# EAGLE design controller (EAGLE 7.3.0)
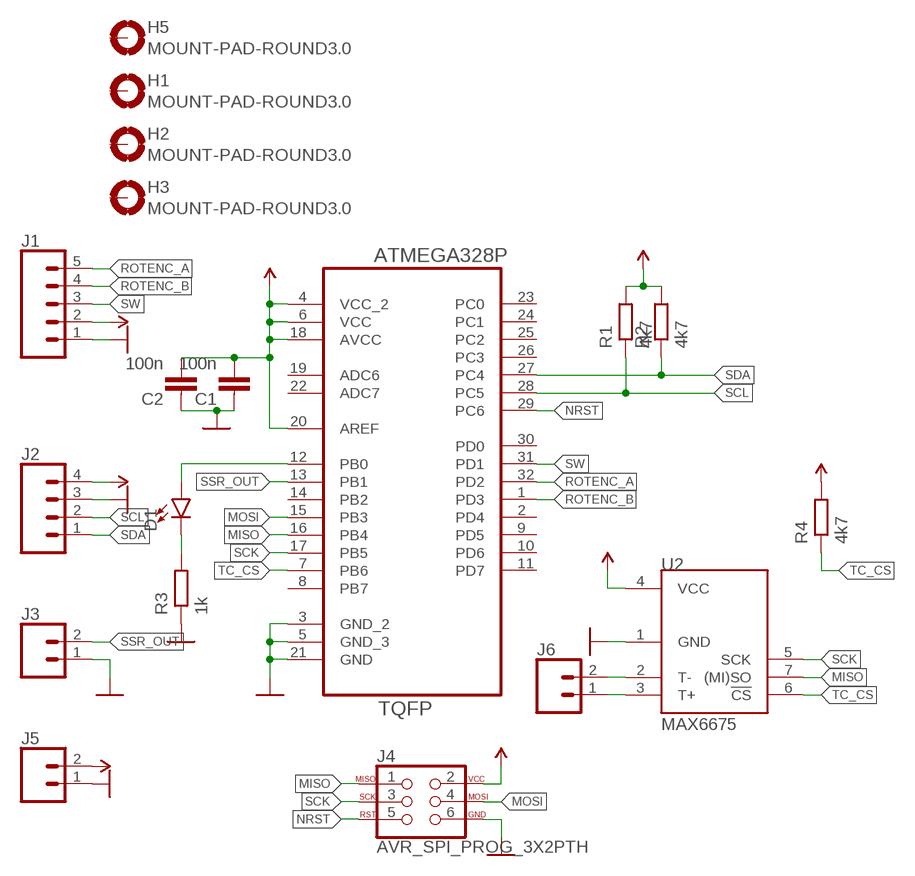
[diagram p0: schematic, sheet 1]

## Parts
C1  100n  CAPACITOR0603-N  [C0603-N]
C2  100n  CAPACITOR0603-N  [C0603-N]
D1  LED0603  [LED-0603]
H1  MOUNT-PAD-ROUND3.0  [3,0-PAD]
H2  MOUNT-PAD-ROUND3.0  [3,0-PAD]
H3  MOUNT-PAD-ROUND3.0  [3,0-PAD]
H5  MOUNT-PAD-ROUND3.0  [3,0-PAD]
J1  CONN_05PTH_LONGPADS  [1X05_LONGPADS]
J2  CONN_04LONGPADS  [1X04_LONGPADS]
J3  CONN_02PTH3  [1X02_LONGPADS]
J4  AVR_SPI_PROG_3X2PTH  [2X3]
J5  CONN_02PTH3  [1X02_LONGPADS]
J6  CONN_02PTH3  [1X02_LONGPADS]
R1  4k7  RESISTOR0603-N  [R0603-N]
R2  4k7  RESISTOR0603-N  [R0603-N]
R3  1k  RESISTOR0603-N  [R0603-N]
R4  4k7  RESISTOR0603-N  [R0603-N]
U1  ATMEGA328P-AU  [QFP80P900X900X120-32N]
U2  MAX6675  [SOIC8]

## Nets
GND: C1.1 C2.1 J1.1 J2.3 J3.1 J4.6 J5.1 R3.1 U1.3(GND_2) U1.5(GND_3) U1.21(GND) U2.1(GND)
MISO: J4.1 U1.16(PB4) U2.7((MI)SO)
MOSI: J4.4 U1.15(PB3)
N$1: D1.A U1.12(PB0)
N$2: D1.C R3.2
N$3: J6.2 U2.2(T-)
N$4: J6.1 U2.3(T+)
NRST: J4.5 U1.29(PC6)
ROTENC_A: J1.5 U1.32(PD2)
ROTENC_B: J1.4 U1.1(PD3)
SCK: J4.3 U1.17(PB5) U2.5(SCK)
SCL: J2.2 R1.1 U1.28(PC5)
SDA: J2.1 R2.1 U1.27(PC4)
SSR_OUT: J3.2 U1.13(PB1)
SW: J1.3 U1.31(PD1)
TC_CS: R4.1 U1.7(PB6) U2.6(!CS)
VCC: C1.2 C2.2 J1.2 J2.4 J4.2 J5.2 R1.2 R2.2 R4.2 U1.4(VCC_2) U1.6(VCC) U1.18(AVCC) U1.20(AREF) U2.4(VCC)
Unconnected: H1.B3,0(MOUNT) H2.B3,0(MOUNT) H3.B3,0(MOUNT) H5.B3,0(MOUNT) U1.2(PD4) U1.8(PB7) U1.9(PD5) U1.10(PD6) U1.11(PD7) U1.14(PB2) U1.19(ADC6) U1.22(ADC7) U1.23(PC0) U1.24(PC1) U1.25(PC2) U1.26(PC3) U1.30(PD0)

## Library data of the parts
C1 C2 = passives-7351:CAPACITOR
D1 = SparkFun-LED:LED: LED (Generic) Standard schematic elements and footprints for 5mm, 3mm, 1206, and 0603 sized LEDs. Generic LEDs with no color specified.
H1-H3 H5 = holes:MOUNT-PAD-ROUND: MOUNTING PAD, round
J1 = SparkFun-Connectors:CONN_05: Multi connection point. Often used as Generic Header-pin footprint for 0.1 inch spaced/style header connections On any of the 0.1 inch spaced packages, you can populate with these: Break Away Headers - Straight <https://www.sparkfun.com/products/116> (PRT-00116) Break Away Male Headers - Right Angle <https://www.sparkfun.com/products/553> (PRT-00553) Female Headers <https://www.sparkfun.com/products/115> (PRT-00115) Break Away Headers - Machine Pin <https://www.sparkfun.com/products/117> (PRT-00117) Break Away Female Headers - Swiss Machine Pin <https://www.sparkfun.com/products/743> (PRT-00743) For SCREWTERMINALS and SPRING TERMINALS visit here: Screw Terimnals on SparkFun.com <https://www.sparkfun.com/search/results?term=Screw+Terminals> (5mm/3.5mm/2.54mm spacing) This device is also useful as a general connection point to wire up your design to another part of your project. Our various solder wires solder well into these plated through hole pads. Hook-Up Wire - Assortment (Stranded, 22 AWG) <https://www.sparkfun.com/products/11375> (PRT-11375) Hook-Up Wire - Assortment (Solid Core, 22 AWG) <https://www.sparkfun.com/products/11367> (PRT-11367) View the entire wire category on our website here <https://www.sparkfun.com/categories/141> Special notes: Molex polarized connector foot print use with SKU : PRT-08231 with associated crimp pins and housings. 1MM SMD Version SKU: PRT-10208
J2 = SparkFun-Connectors:CONN_04: Multi connection point. Often used as Generic Header-pin footprint for 0.1 inch spaced/style header connections On any of the 0.1 inch spaced packages, you can populate with these: Break Away Headers - Straight <https://www.sparkfun.com/products/116> (PRT-00116) Break Away Male Headers - Right Angle <https://www.sparkfun.com/products/553> (PRT-00553) Female Headers <https://www.sparkfun.com/products/115> (PRT-00115) Break Away Headers - Machine Pin <https://www.sparkfun.com/products/117> (PRT-00117) Break Away Female Headers - Swiss Machine Pin <https://www.sparkfun.com/products/743> (PRT-00743) For SCREWTERMINALS and SPRING TERMINALS visit here: Screw Terimnals on SparkFun.com <https://www.sparkfun.com/search/results?term=Screw+Terminals> (5mm/3.5mm/2.54mm spacing) This device is also useful as a general connection point to wire up your design to another part of your project. Our various solder wires solder well into these plated through hole pads. Hook-Up Wire - Assortment (Stranded, 22 AWG) <https://www.sparkfun.com/products/11375> (PRT-11375) Hook-Up Wire - Assortment (Solid Core, 22 AWG) <https://www.sparkfun.com/products/11367> (PRT-11367) View the entire wire category on our website here <https://www.sparkfun.com/categories/141> Special notes: Molex polarized connector foot print use with SKU : PRT-08231 with associated crimp pins and housings. 1MM SMD Version SKU: PRT-10208; PROD_ID: CONN-09696
J3 J5 J6 = SparkFun-Connectors:CONN_02: Multi connection point. Often used as Generic Header-pin footprint for 0.1 inch spaced/style header connections On any of the 0.1 inch spaced packages, you can populate with these: Break Away Headers - Straight <https://www.sparkfun.com/products/116> (PRT-00116) Break Away Male Headers - Right Angle <https://www.sparkfun.com/products/553> (PRT-00553) Female Headers <https://www.sparkfun.com/products/115> (PRT-00115) Break Away Headers - Machine Pin <https://www.sparkfun.com/products/117> (PRT-00117) Break Away Female Headers - Swiss Machine Pin <https://www.sparkfun.com/products/743> (PRT-00743) For SCREWTERMINALS and SPRING TERMINALS visit here: Screw Terimnals on SparkFun.com <https://www.sparkfun.com/search/results?term=Screw+Terminals> (5mm/3.5mm/2.54mm spacing) This device is also useful as a general connection point to wire up your design to another part of your project. Our various solder wires solder well into these plated through hole pads. Hook-Up Wire - Assortment (Stranded, 22 AWG) <https://www.sparkfun.com/products/11375> (PRT-11375) Hook-Up Wire - Assortment (Solid Core, 22 AWG) <https://www.sparkfun.com/products/11367> (PRT-11367) View the entire wire category on our website here <https://www.sparkfun.com/categories/141> Special notes: Molex polarized connector foot print use with: PRT-08233 with associated crimp pins and housings. 2.54_SCREWTERM for use with PRT-10571. 3.5mm Screw Terminal footprints for PRT-08084 5mm Screw Terminal footprints for use with PRT-08432
J4 = SparkFun-Connectors:AVR_SPI_PROG_3X2: AVR ISP 6 Pin This is the reduced ISP connector for AVR programming. Common on Arduino. This footprint will take up less PCB space and can be used with a 10-pin to 6-pin adapter such as SKU: BOB-08508 **Special note about "TEST_POINT" package. The stop mask is on the top side, so if you want your programming test points to be on the bottom of your board, make sure to place this package on the bottom side of the board. This also ensure that the orientation to program from the bottom side will be correct. SparkFun Products: SparkFun ISP Pogo Adapter <https://www.sparkfun.com/products/11591> - NS Tiny AVR Programmer <https://www.sparkfun.com/products/11801> -PTH
R1-R4 = passives-7351:RESISTOR
U1 = Ava:ATMEGA328P-AU; DESCRIPTION: 8-bit Microcontroller with In-System Programmable Flash; MPN: ATMEGA328P-AU; OC_FARNELL: 1715486; OC_NEWARK: 14R4631; PACKAGE: TQFP-32; SUPPLIER: Atmel
U2 = SparkFun-Retired:MAX6675: Cold-Junction-Compensated K-Thermocoupleto-Digital Converter (0°C to +1024°C) The MAX6675 performs cold-junction compensation and digitizes the signal from a type-K thermocouple. The data is output in a 12-bit resolution, SPI™-compatible, read-only format. This converter resolves temperatures to 0.25°C, allows readings as high as +1024°C, and exhibits thermocouple accuracy of 8LSBs for temperatures ranging from 0°C to +700°C. Dead Prototype: IC-12512; PROD_ID: IC-12512

## Board
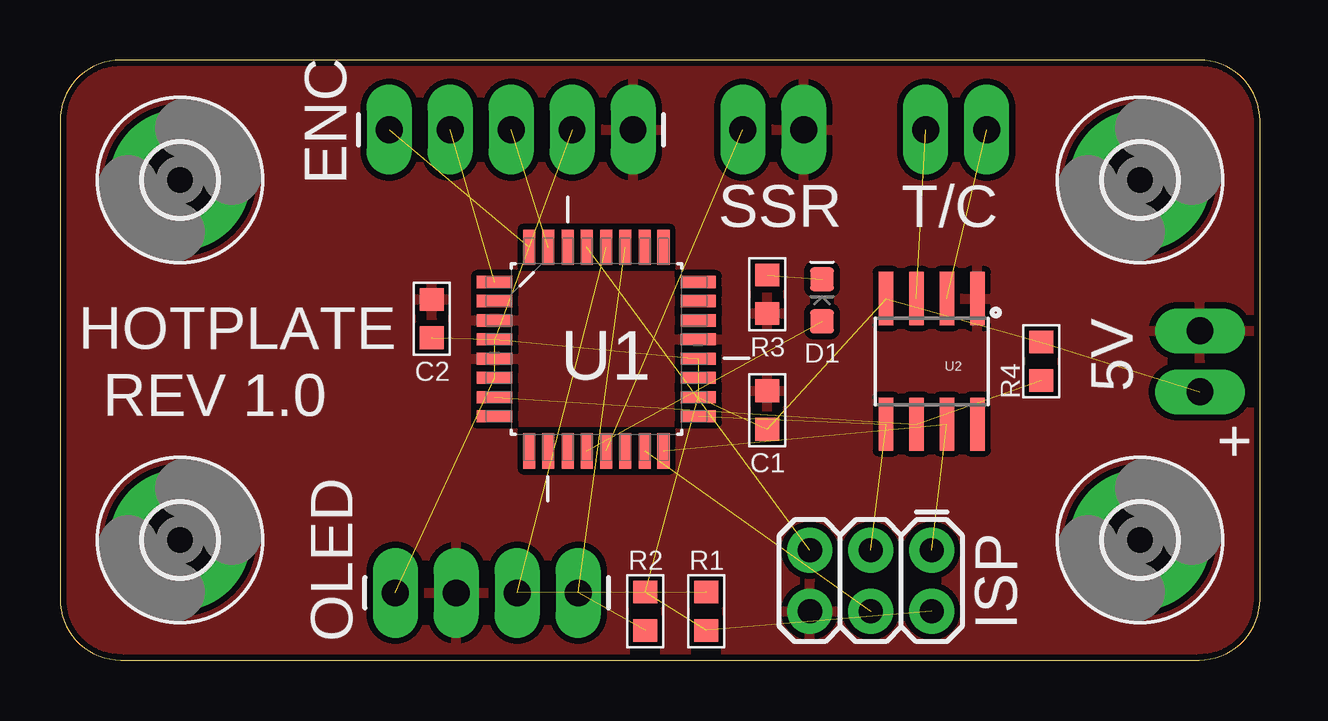
[diagram p1: board, top side]
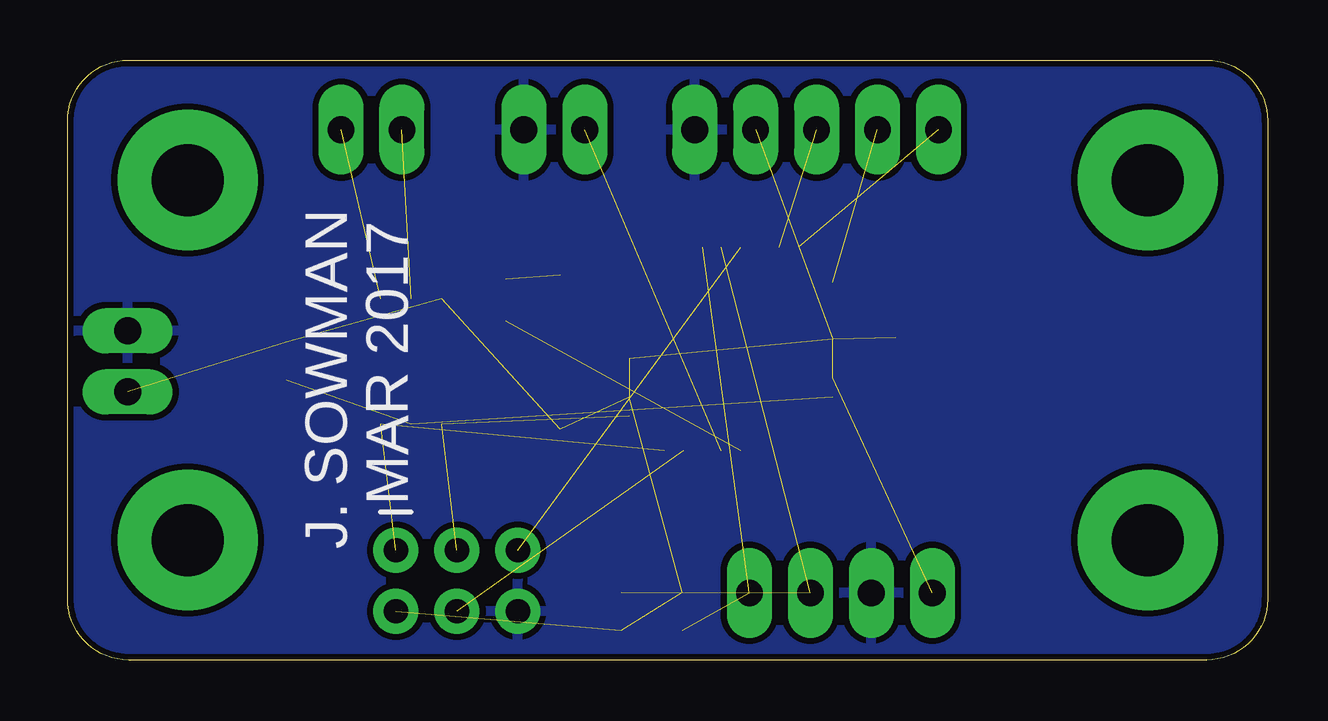
[diagram p2: board, bottom side, seen from below]

Size 50 x 25 mm. Coordinates in mm from the lower left corner, seen from the top.
Outline: 0,22.46 0,2.54 arc90 2.54,0 47.46,0 arc90 50,2.54 50,22.46 arc90 47.46,25 2.54,25 arc90 0,22.46
Copper layers (1*16): Top 0.035mm / dielectric 1.5mm / Bottom 0.035mm
Design rules "dirt_cheap_dirty_boards.v1": minimum track width 5mil, minimum drill 12mil, track to track 5mil, track to pad 5mil, pad to pad 5mil, via to via 5mil, smd to smd 0mil, copper to edge 10mil, drill to drill 10mil, minimum pad ring 10mil, minimum via ring 6mil, stop-mask expansion 2mil, vias tented up to drill 25mil, thermal gap 10mil

### Footprints (pad centres in the part's own frame; a part is rotated, then mirrored left to right if it is on the bottom)
C0603-N = smd 0.95 x 1: 1 -0.8,0; 2 0.8,0
LED-0603 = smd 1 x 1: A -0.877,0; C 0.877,0
3,0-PAD = drill 3 pad 5.842: B3,0 0,0
1X05_LONGPADS = drill 1.118 pad 1.88 long: 1 0,0; 2 2.54,0; 3 5.08,0; 4 7.62,0; 5 10.16,0
1X04_LONGPADS = drill 1.118 pad 1.88 long: 1 0,0; 2 2.54,0; 3 5.08,0; 4 7.62,0
1X02_LONGPADS = drill 1.118 pad 1.88 long: 1 0,0; 2 2.54,0
2X3 = drill 1.016 pad 1.88: 1 0,0; 2 0,2.54; 3 2.54,0; 4 2.54,2.54; 5 5.08,0; 6 5.08,2.54
R0603-N = smd 0.95 x 1: 1 -0.8,0; 2 0.8,0
QFP80P900X900X120-32N = smd 1.473 x 0.508: 1 -4.242,2.794; 2 -4.242,2.007; 3 -4.242,1.194; 4 -4.242,0.406; 5 -4.242,-0.406; 6 -4.242,-1.194; 7 -4.242,-2.007; 8 -4.242,-2.794; 17 4.242,-2.794; 18 4.242,-2.007; 19 4.242,-1.194; 20 4.242,-0.406; 21 4.242,0.406; 22 4.242,1.194; 23 4.242,2.007; 24 4.242,2.794 | smd 0.508 x 1.473: 9 -2.794,-4.242; 10 -2.007,-4.242; 11 -1.194,-4.242; 12 -0.406,-4.242; 13 0.406,-4.242; 14 1.194,-4.242; 15 2.007,-4.242; 16 2.794,-4.242; 25 2.794,4.242; 26 2.007,4.242; 27 1.194,4.242; 28 0.406,4.242; 29 -0.406,4.242; 30 -1.194,4.242; 31 -2.007,4.242; 32 -2.794,4.242
SOIC8 = smd 0.61 x 2.21: 1 -1.905,-2.616; 2 -0.635,-2.616; 3 0.635,-2.616; 4 1.905,-2.616; 5 1.905,2.616; 6 0.635,2.616; 7 -0.635,2.616; 8 -1.905,2.616

### Placement (x,y rotation side)
C1  29.46,10.41 270 top
C2  15.49,14.22 270 top
D1  31.75,14.99 90 top
H1  5,20 0 top
H2  45,20 0 top
H3  45,5 0 top
H5  5,5 0 top
J1  23.88,22.1 180 top
J2  21.59,2.79 180 top
J3  30.99,22.1 180 top
J4  36.32,4.57 180 top
J5  47.5,13.72 270 top
J6  36.07,22.1 0 top
R1  26.92,2.03 270 top
R2  24.38,2.03 90 top
R3  29.46,15.24 90 top
R4  40.89,12.45 90 top
U1  22.35,12.95 0 top
U2  36.32,12.45 180 top

### Tracks (layer width: path | path; a pad name or v marks a point on that pad's centre or on a via)
GND
  pour Top (isolate 0.254): 0,0 50,0 50,25 0,25
  pour Bottom (isolate 0.254): 0,25 50,25 50,0 0,0
MISO  (2 unrouted)
MOSI  (1 unrouted)
N$1  (1 unrouted)
N$2  (1 unrouted)
N$3  (1 unrouted)
N$4  (1 unrouted)
NRST  (1 unrouted)
ROTENC_A  (1 unrouted)
ROTENC_B  (1 unrouted)
SCK  (2 unrouted)
SCL  (2 unrouted)
SDA  (2 unrouted)
SSR_OUT  (1 unrouted)
SW  (1 unrouted)
TC_CS  (2 unrouted)
VCC  (13 unrouted)

### Text on the board
tPlace: ENC | SSR | T/C | HOTPLATE | 5V | REV 1.0 | + | OLED | ISP
bPlace: J. SOWMAN | MAR 2017